# EAGLE design 3clamp_pulse_conv (EAGLE 6.1)
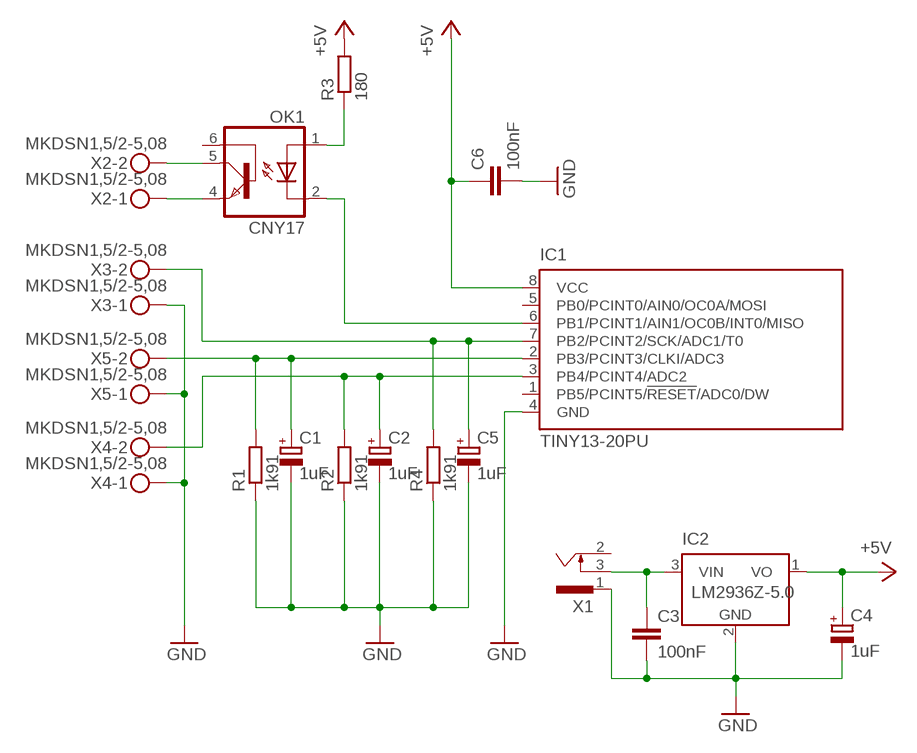
[diagram p0: schematic, sheet 1]

## Parts
C1  1uF  CPOL-EUE2.5-5  [E2,5-5]
C2  1uF  CPOL-EUE2.5-5  [E2,5-5]
C3  100nF  C-EU025-025X050  [C025-025X050]
C4  1uF  CPOL-EUE2.5-5  [E2,5-5]
C5  1uF  CPOL-EUE2.5-5  [E2,5-5]
C6  100nF  C-EU025-025X050  [C025-025X050]
IC1  TINY13-20PU  [DIL08]
IC2  LM2936Z-5.0  [TO92]
OK1  CNY17  [DIL06]
R1  1k91  R-EU_0204/7  [0204/7]
R2  1k91  R-EU_0204/7  [0204/7]
R3  180  R-EU_0204/7  [0204/7]
R4  1k91  R-EU_0204/7  [0204/7]
X1  SCD-014A  [SCD-014-A]
X2  MKDSN1,5/2-5,08  [MKDSN1,5/2-5,08]
X3  MKDSN1,5/2-5,08  [MKDSN1,5/2-5,08]
X4  MKDSN1,5/2-5,08  [MKDSN1,5/2-5,08]
X5  MKDSN1,5/2-5,08  [MKDSN1,5/2-5,08]

## Nets
+5V: C4.+ C6.1 IC1.8(VCC) IC2.1(VO) R3.2
GND: C1.- C2.- C3.2 C4.- C5.- C6.2 IC1.4(GND) IC2.2(GND) R1.1 R2.1 R4.1 X1.1 X3.1 X4.1 X5.1
N$1: C3.1 IC2.3(VIN) X1.3
N$2: C1.+ IC1.2(PB3/PCINT3/CLKI/ADC3) R1.2 X5.2
N$3: C2.+ IC1.3(PB4/PCINT4/ADC2) R2.2 X4.2
N$5: C5.+ IC1.7(PB2/PCINT2/SCK/ADC1/T0) R4.2 X3.2
N$6: OK1.1(A) R3.1
N$7: IC1.6(PB1/PCINT1/AIN1/OC0B/INT0/MISO) OK1.2(C)
N$8: OK1.5(COL) X2.2
N$9: OK1.4(EMI) X2.1
Unconnected: IC1.1(PB5/PCINT5/!RESET!/ADC0/DW) IC1.5(PB0/PCINT0/AIN0/OC0A/MOSI) OK1.6(BAS) X1.2

## Library data of the parts
C1 C2 C4 C5 = rcl:CPOL-EU: POLARIZED CAPACITOR, European symbol
C3 C6 = rcl:C-EU: CAPACITOR, European symbol
IC1 = atmel:TINY13: 8-bit AVR Microcontroller with 1K Bytes In-System Programmable Flash Source: http://www.atmel.com/dyn/resources/prod_documents/2535S.pdf; MPN: ATTINY13-20PU; OC_FARNELL: 9171550; OC_NEWARK: 96K6521
IC2 = national-semiconductor:LM2936?*: Ultra-Low Quiescent Current LDO Voltage Regulator Source: Data sheet <http://www.national.com/ds/LM/LM2936.pdf>; MF: NATIONAL SEMICONDUCTOR; MPN: LM2936Z-5.0/NOPB; OC_FARNELL: 1150143; OC_NEWARK: 41K4533
OK1 = optocoupler:CNY17: SIEMENS OPTO COUPLER; MPN: CNY17-1; OC_FARNELL: 1045399; OC_NEWARK: 05M4044
R1-R4 = rcl:R-EU_: RESISTOR, European symbol
X1 = con-shiua-chyuan:SCD-014A: Power Jack 2.5mm; OC_FARNELL: unknown; OC_NEWARK: unknown
X2-X5 = con-phoenix-508:MKDSN1,5/2-5,08: MKDSN 1,5/ 2-5,08 Printklemme Nennstrom: 13,5 A Nennspannung: 250 V Rastermaß: 5,08 mm Polzahl: 2 Anschlussart: Schraubanschluss Montage: Löten Anschlussrichtung Leiter/Platine: 0 ° Artikelnummer: 1729128 Source: http://eshop.phoenixcontact.com .. 1729128.pdf; MPN: MKDSN 1,5/2-5.08; OC_FARNELL: 1792903; OC_NEWARK: 30M2397

## Board
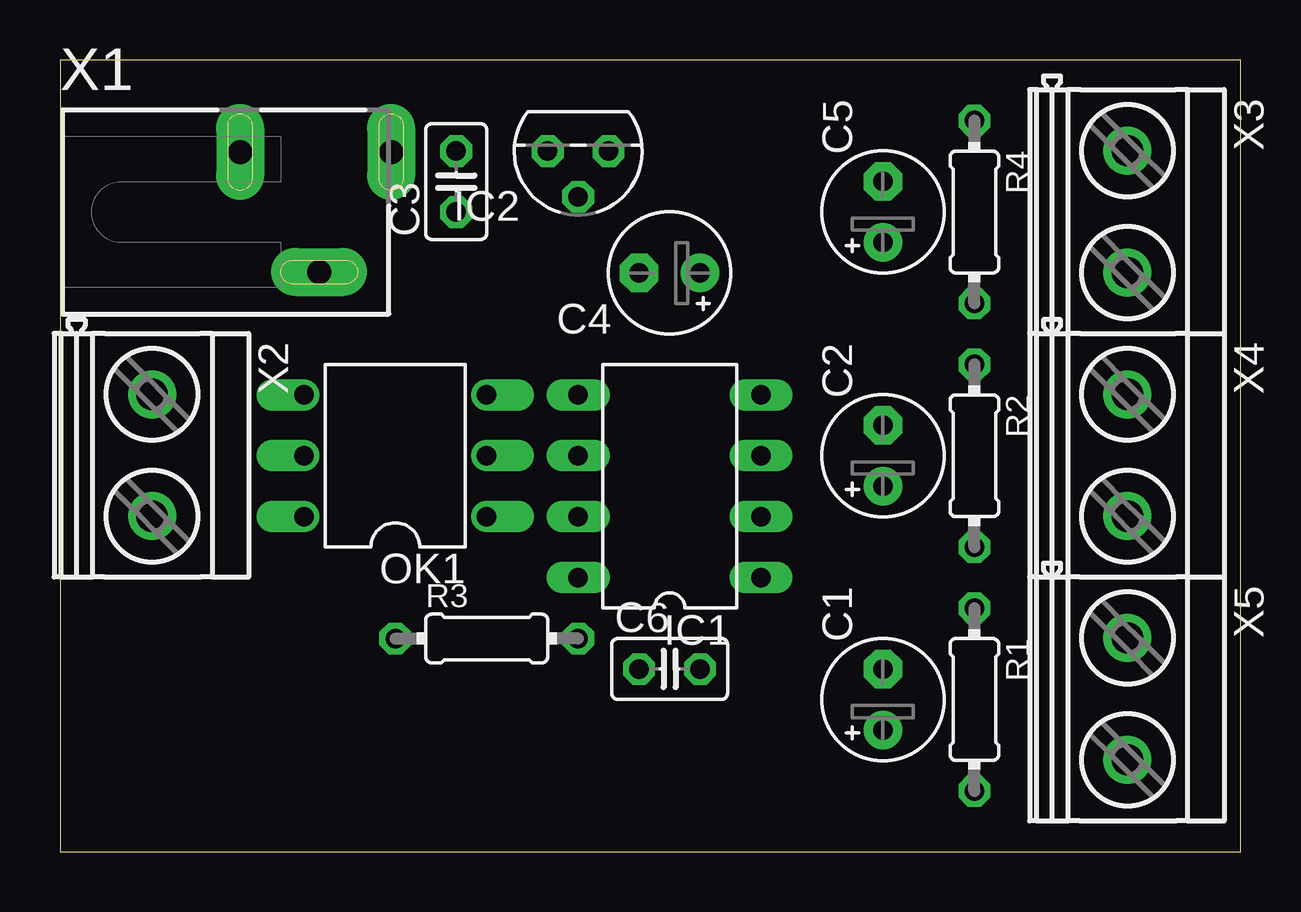
[diagram p1: board, top side]
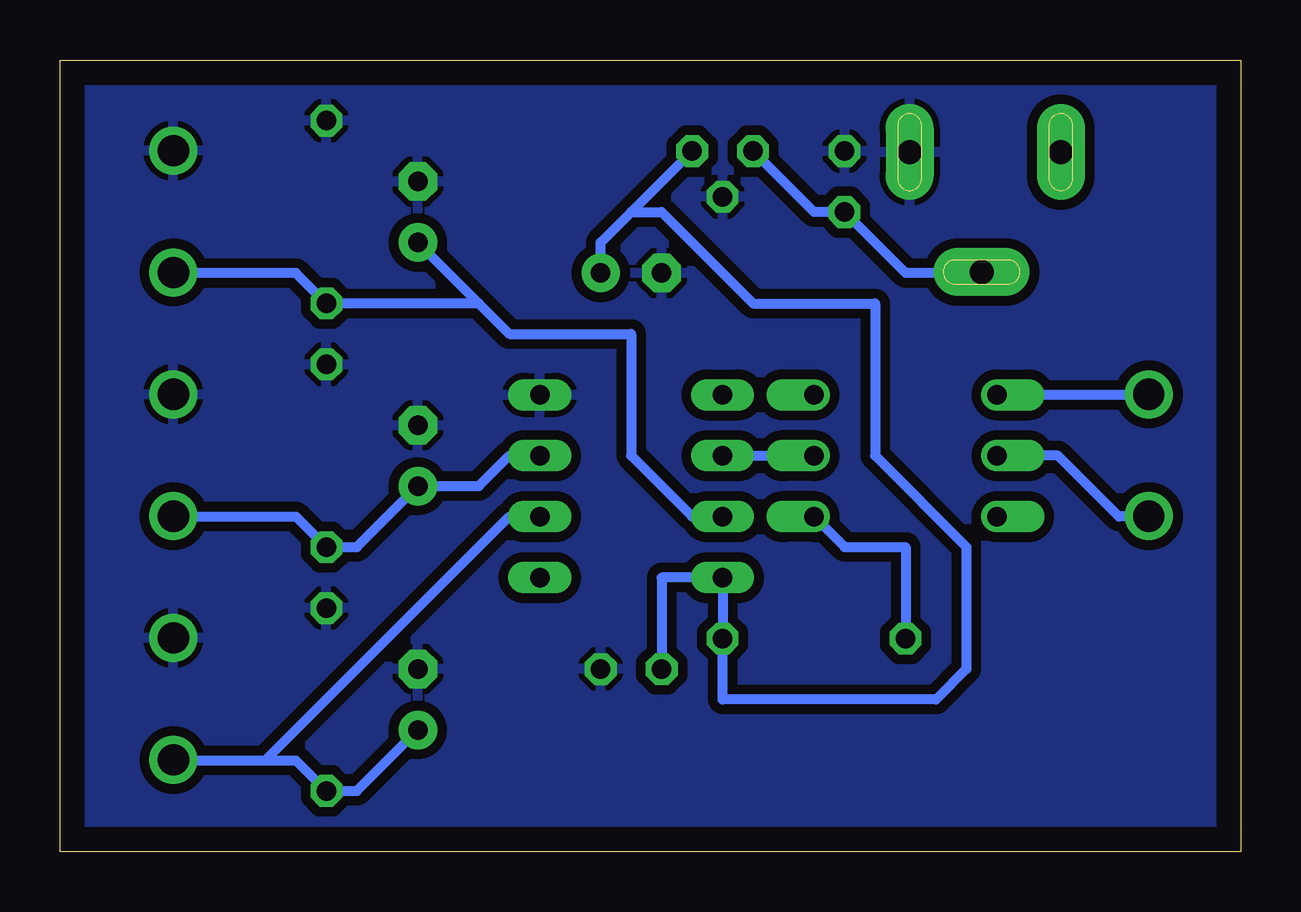
[diagram p2: board, bottom side, seen from below]

Size 49.2 x 33.01 mm. Coordinates in mm from the lower left corner, seen from the top.
Outline: 0,0 49.2,0 49.2,33.01 0,33.01 0,0
Copper layers (1*16): Top 0.035mm / dielectric 1.5mm / Bottom 0.035mm
Design rules: minimum track width 16mil, minimum drill 24mil, track to track 16mil, track to pad 16mil, pad to pad 16mil, via to via 16mil, smd to smd 8mil, copper to edge 40mil, drill to drill 16mil, minimum pad ring 10mil, minimum via ring 8mil, stop-mask expansion 4mil, vias tented up to drill 0mil, thermal gap 10mil

### Footprints (pad centres in the part's own frame; a part is rotated, then mirrored left to right if it is on the bottom)
E2,5-5 = drill 0.813 pad 1.6: + -1.27,0 | drill 0.813 pad 1.6 octagon: - 1.27,0
C025-025X050 = drill 0.813 octagon: 1 -1.27,0; 2 1.27,0
DIL08 = drill 0.813 long: 1 -3.81,-3.81; 2 -1.27,-3.81; 3 1.27,-3.81; 4 3.81,-3.81; 5 3.81,3.81; 6 1.27,3.81; 7 -1.27,3.81; 8 -3.81,3.81
TO92 = drill 0.813 pad 1.27 octagon: 1 -1.27,0; 2 0,1.905; 3 1.27,0
DIL06 = drill 0.813 offset: 1 -2.54,-3.81; 2 0,-3.81; 3 2.54,-3.81; 4 2.54,3.81; 5 0,3.81; 6 -2.54,3.81
0204/7 = drill 0.813 octagon: 1 -3.81,0; 2 3.81,0
SCD-014-A = drill 1 pad 2 long: 1 -2.5,13.8; 2 -2.5,7.5; 3 2.5,10.8
MKDSN1,5/2-5,08 = drill 1.3 pad 2: 1 -2.561,0.025; 2 2.519,0.025

### Placement (x,y rotation side)
C1  34.29,6.35 90 top
C2  34.29,16.51 90 top
C3  16.51,27.94 90 top
C4  25.4,24.13 180 top
C5  34.29,26.67 90 top
C6  25.4,7.62 0 top
IC1  25.4,15.24 90 top
IC2  21.59,29.21 180 top
OK1  13.97,16.51 90 top
R1  38.1,6.35 270 top
R2  38.1,16.51 270 top
R3  17.78,8.89 0 top
R4  38.1,26.67 270 top
X1  0,26.67 270 top
X2  3.81,16.51 270 top
X3  44.45,26.67 270 top
X4  44.45,16.51 270 top
X5  44.45,6.35 270 top

### Tracks (layer width: path | path; a pad name or v marks a point on that pad's centre or on a via)
+5V
  Bottom 0.406: C6.1 24.13,11.43 IC1.8 R3.2 21.59,6.35 12.7,6.35 11.43,7.62 11.43,12.7 15.24,16.51 15.24,22.86 20.32,22.86 24.13,26.67 25.4,26.67 | 25.4,26.67 26.67,25.4 C4.+ | 25.4,26.67 IC2.1
GND
  pour Bottom: 0,33.02 49.53,33.02 49.53,0 0,0
N$1
  Bottom 0.406: X1.3 11.43,24.13 13.97,24.13 C3.1 17.78,26.67 IC2.3
N$2
  Bottom 0.406: 40.64,3.81 44.45,3.81 X5.2 | 40.64,3.81 39.37,3.81 R1.2 36.83,2.54 C1.+ | IC1.2 30.48,13.97 40.64,3.81
N$3
  Bottom 0.406: IC1.3 30.48,16.51 31.75,15.24 C2.+ 36.83,12.7 R2.2 39.37,13.97 44.45,13.97 X4.2
N$5
  Bottom 0.406: IC1.7 22.86,13.97 25.4,16.51 25.4,21.59 30.48,21.59 31.75,22.86 | C5.+ 31.75,22.86 | 31.75,22.86 R4.2 39.37,24.13 44.45,24.13 X3.2
N$6
  Bottom 0.406: R3.1 13.97,12.7 16.51,12.7 OK1.1
N$7
  Bottom 0.406: IC1.6 OK1.2
N$8
  Bottom 0.406: OK1.5 7.62,16.51 5.08,13.97 3.81,13.97 X2.2
N$9
  Bottom 0.406: OK1.4 3.81,19.05 X2.1